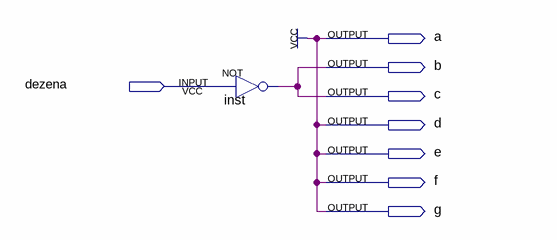
[diagram p0: schematic sheet]
// Quartus schematic U1.bdf as structural Verilog: 1 symbols, 8 pins
module U1 (
  input  dezena,
  output a,
  output b,
  output c,
  output d,
  output e,
  output f,
  output g
);

  not inst (b, dezena);

  assign a = 1'b1;
  assign c = b;
  assign d = 1'b1;
  assign e = 1'b1;
  assign f = 1'b1;
  assign g = 1'b1;
endmodule
